# EAGLE design inductance_meter (EAGLE 9.6.2)
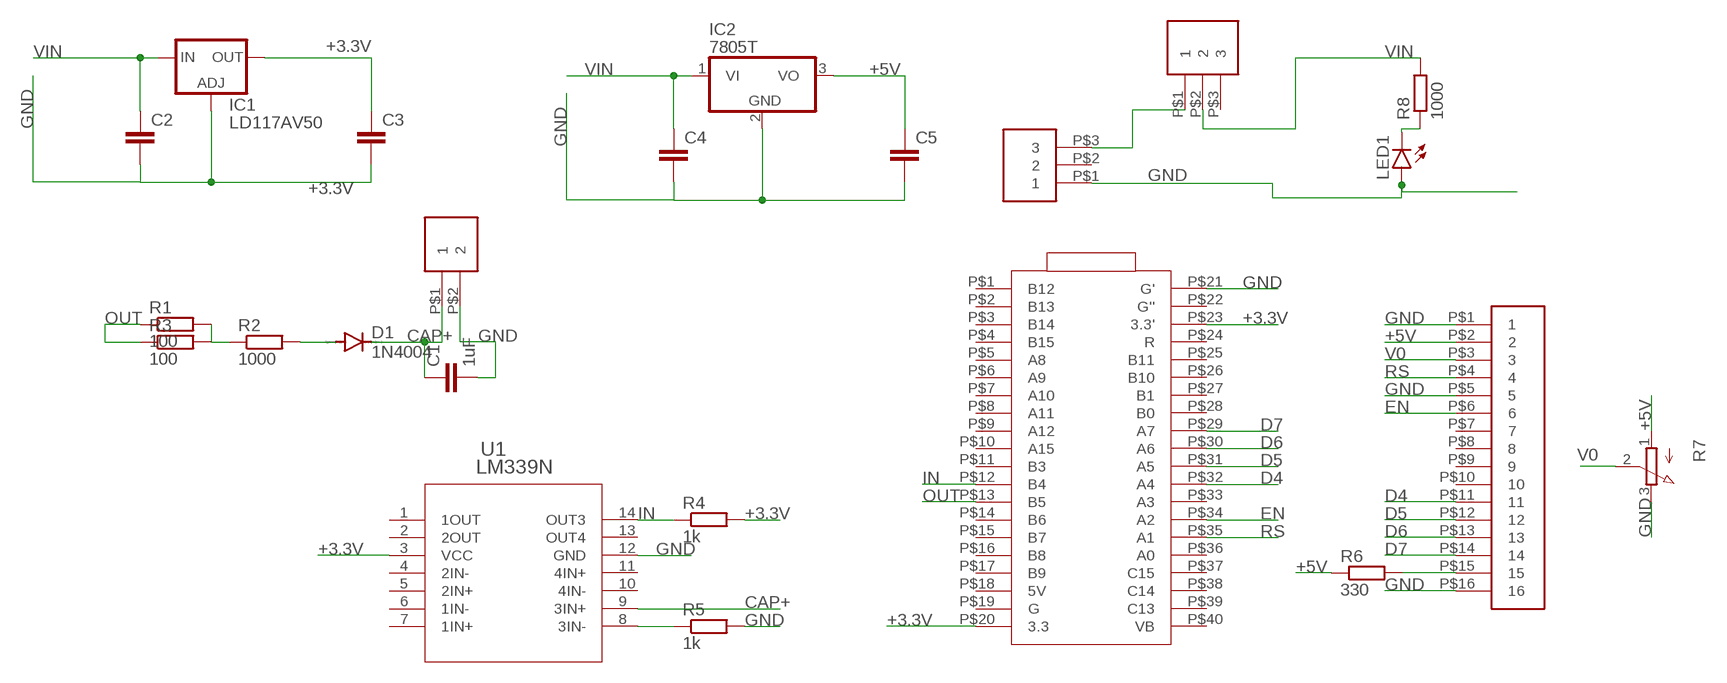
[diagram p0: schematic, sheet 1]

## Parts
C1  1uF  C-EU050-075X075  [C050-075X075]
C2  C-EU025-030X050  [C025-030X050]
C3  C-EU025-030X050  [C025-030X050]
C4  C-EU025-030X050  [C025-030X050]
C5  C-EU025-030X050  [C025-030X050]
D1  1N4004  [DO41-10]
IC1  LD117AV50  [TO220L1]
IC2  7805T  [TO220H]
LED1  TLLR4400  [LED3MM]
R1  100  R-EU_0817/22  [P0817/22]
R2  1000  R-EU_0817/22  [P0817/22]
R3  100  R-EU_0817/22  [P0817/22]
R4  1k  R-EU_0817/22  [P0817/22]
R5  1k  R-EU_0817/22  [P0817/22]
R6  330  R-EU_0617/17  [0617/17]
R7  3RP/1610N  [3RP/1610N]
R8  1000  R-EU_0817/22  [P0817/22]
U1  LM339N  [PDIP14_6P60X19P69_ONS]
U$2  HEADER_16  [HEADER_16_FOOT]
U$3  BLUE_PILL_EA  [BLUE_PILL_FOOT]
U$5  HEADER_2  [HEADER_2_FOOT]
U$7  HEADER_3  [HEADER_3_FOOT]
U$9  HEADER_3  [HEADER_3_FOOT]

## Nets
+3.3V: C3.1 IC1.2(OUT) R4.2 U1.3(VCC) U$3.P$20(3.3) U$3.P$23(3.3')
+5V: C5.1 IC2.3(VO) R6.1 R7.1(A) U$2.P$2
CAP+: C1.1 D1.C U1.9(3IN+) U$5.P$1
D4: U$2.P$11 U$3.P$32(A4)
D5: U$2.P$12 U$3.P$31(A5)
D6: U$2.P$13 U$3.P$30(A6)
D7: U$2.P$14 U$3.P$29(A7)
EN: U$2.P$6 U$3.P$34(A2)
GND: C1.2 C2.2 C3.2 C4.2 C5.2 IC1.1(ADJ) IC2.2(GND) LED1.A R5.2 R7.3(E) U1.12(GND) U$2.P$1 U$2.P$5 U$2.P$16 U$3.P$21(G') U$5.P$2 U$9.P$1
IN: R4.1 U1.14(OUT3) U$3.P$12(B4)
N$1: R6.2 U$2.P$15
N$2: R5.1 U1.8(3IN-)
N$3: R1.2 R2.1 R3.2
N$4: D1.A R2.2
N$5: LED1.K(C) R8.1
N$10: U$7.P$1 U$9.P$3
OUT: R1.1 R3.1 U$3.P$13(B5)
RS: U$2.P$4 U$3.P$35(A1)
V0: R7.2(S) U$2.P$3
VIN: C2.1 C4.1 IC1.3(IN) IC2.1(VI) R8.2 U$7.P$2
Unconnected: U1.1(1OUT) U1.2(2OUT) U1.4(2IN-) U1.5(2IN+) U1.6(1IN-) U1.7(1IN+) U1.10(4IN-) U1.11(4IN+) U1.13(OUT4) U$2.P$7 U$2.P$8 U$2.P$9 U$2.P$10 U$3.P$1(B12) U$3.P$2(B13) U$3.P$3(B14) U$3.P$4(B15) U$3.P$5(A8) U$3.P$6(A9) U$3.P$7(A10) U$3.P$8(A11) U$3.P$9(A12) U$3.P$10(A15) U$3.P$11(B3) U$3.P$14(B6) U$3.P$15(B7) U$3.P$16(B8) U$3.P$17(B9) U$3.P$18(5V) U$3.P$19(G) U$3.P$22(G'') U$3.P$24(R) U$3.P$25(B11) U$3.P$26(B10) U$3.P$27(B1) U$3.P$28(B0) U$3.P$33(A3) U$3.P$36(A0) U$3.P$37(C15) U$3.P$38(C14) U$3.P$39(C13) U$3.P$40(VB) U$7.P$3 U$9.P$2

## Library data of the parts
C1-C5 = rcl:C-EU: CAPACITOR, European symbol; SPICEPREFIX: C
D1 = diode:1N4004: DIODE general purpose rectifier, 1 A
IC1 = v-reg:LD117A?*: Low drop fixed and adjustable positive voltage regulators 1 A Source: http://www.st.com/stonline/products/literature/ds/7194/ld1117axx.pdf
IC2 = linear:78*: Positive VOLTAGE REGULATOR Source: http://cache.national.com/ds/LM/LM78L05.pdf http://www.fairchildsemi.com/ds/LM/LM7805.pdf
LED1 = led:TLLR4400: Low Current (2mA) LED 3 mm Tinted Diffused Package color RED Source: Data sheet <http://www.farnell.com/datasheets/391100.pdf>; MF: VISHAY SEMICONDUCTOR; OC_FARNELL: 1612437
R1-R6 R8 = rcl:R-EU_: RESISTOR, European symbol; SPICEPREFIX: R
R7 = pot:3RP/1610N: 16mm Potentiometer one level Source: http://www.alphapotentiometers.net/html/16mm_pot_2.html
U1 = lm339:LM339N; BUILT_BY: EMA_Jessica; COPYRIGHT: Copyright (C) 2018 Accelerated Designs. All rights reserved; MANUFACTURER_PART_NUMBER: LM339N; SOURCELIBRARY: ON_Semiconductor_2019-12-30; VENDOR: ON Semiconductor
U$2 = header:HEADER_16
U$3 = blue_pill_ea:BLUE_PILL_EA
U$5 = header:HEADER_2
U$7 U$9 = header:HEADER_3

## Board
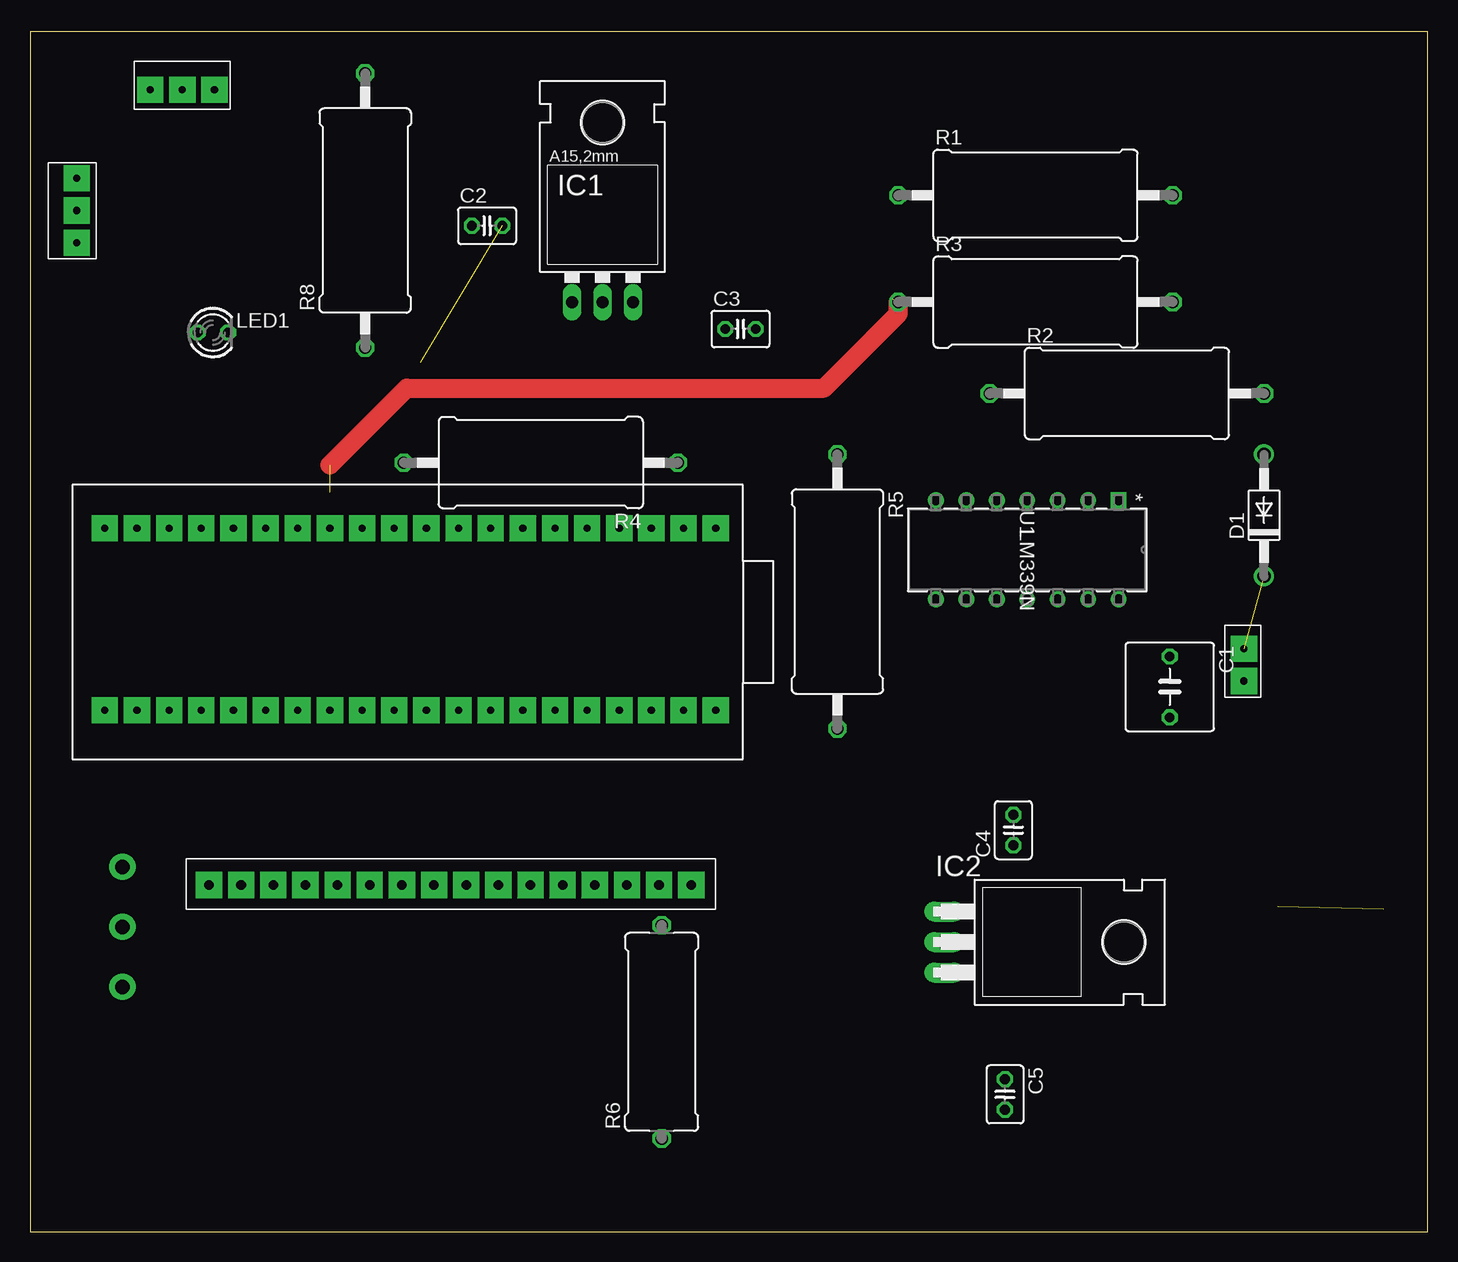
[diagram p1: board, top side]
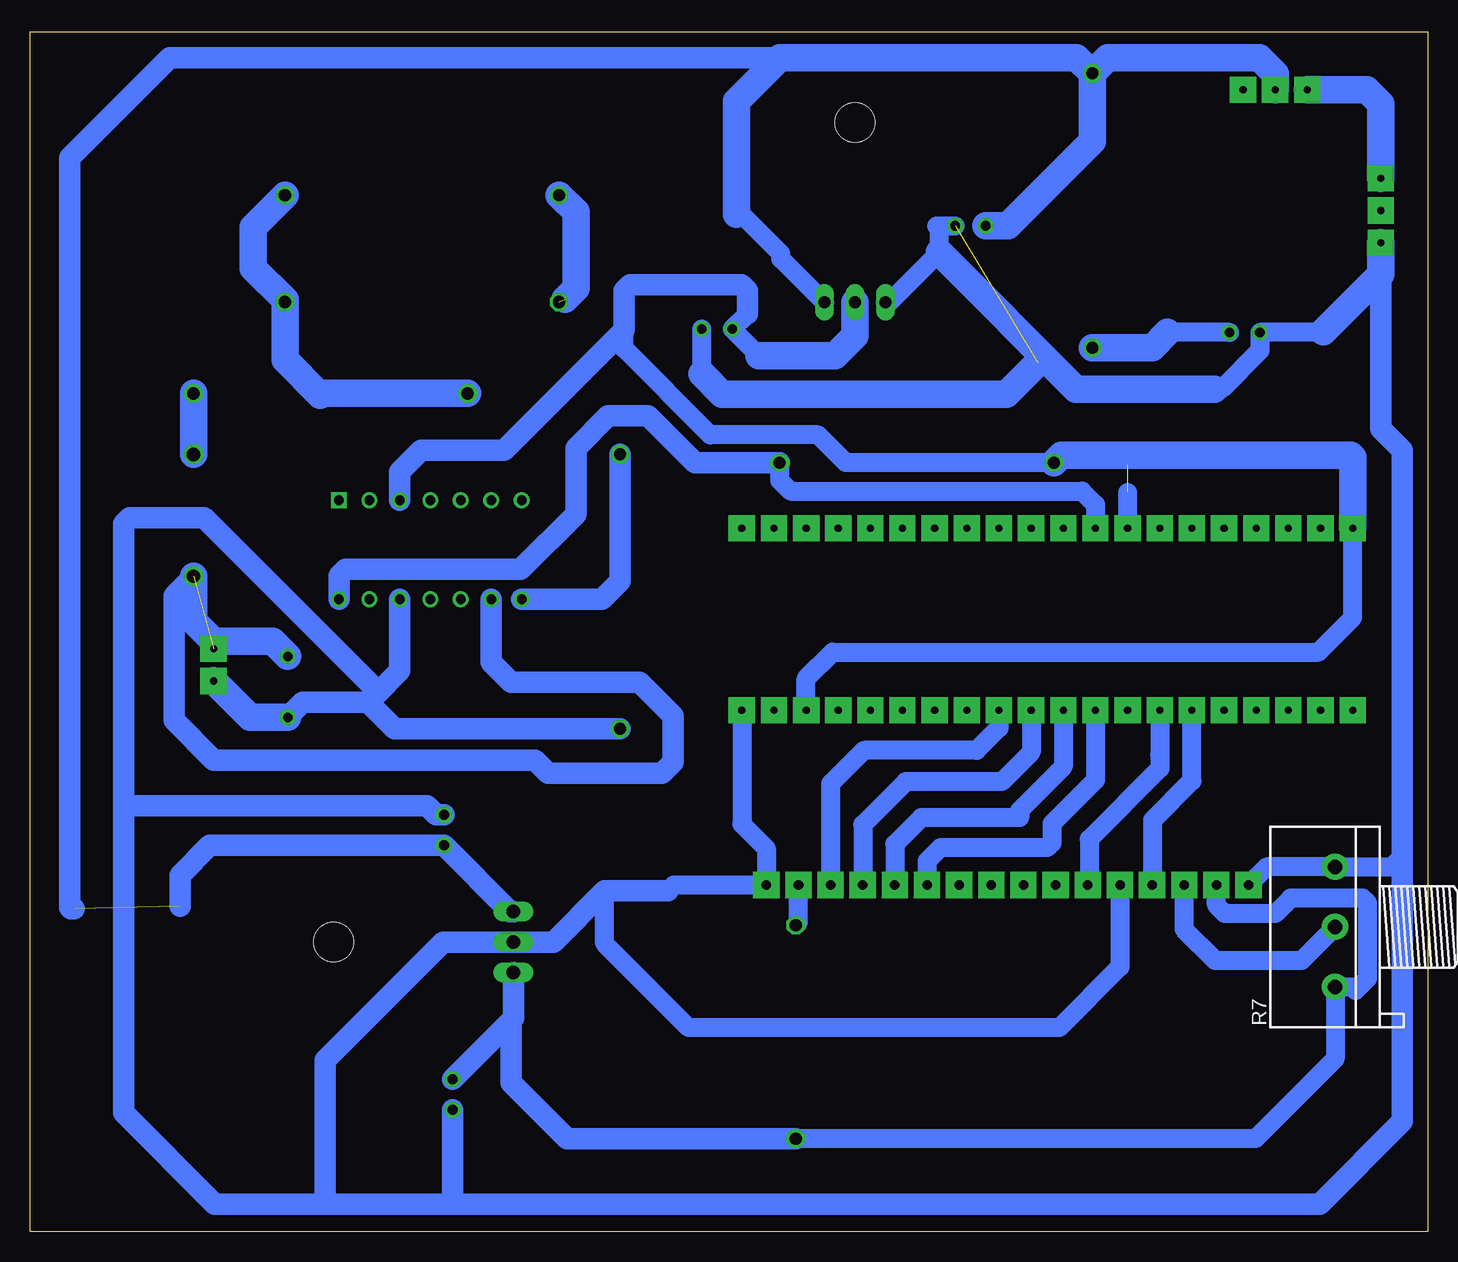
[diagram p2: board, bottom side, seen from below]

Size 116.5 x 100 mm. Coordinates in mm from the lower left corner, seen from the top.
Outline: 0,0 116.5,0 116.5,100 0,100 0,0
Copper layers (1*16): Top 0.035mm / dielectric 1.5mm / Bottom 0.035mm
Design rules "default": minimum track width 6mil, minimum drill 0.35mm, track to track 6mil, track to pad 6mil, pad to pad 6mil, via to via 6mil, smd to smd 6mil, copper to edge 40mil, drill to drill 6mil, minimum pad ring 10mil, minimum via ring 8mil, stop-mask expansion 4mil, vias tented up to drill 0mil, thermal gap 10mil

### Footprints (pad centres in the part's own frame; a part is rotated, then mirrored left to right if it is on the bottom)
C050-075X075 = drill 0.813 octagon: 1 -2.54,0; 2 2.54,0
C025-030X050 = drill 0.813 octagon: 1 -1.27,0; 2 1.27,0
DO41-10 = drill 1.118: A 5.08,0; C -5.08,0
TO220L1 = drill 1.016 long: 1 -2.54,-3.81; 2 0,-3.81; 3 2.54,-3.81 | hole 3.302: 0,11.176
TO220H = drill 1.118 long: 1 -2.54,-10.16; 2 0,-10.16; 3 2.54,-10.16 | hole 3.302: 0,4.826
LED3MM = drill 0.813 octagon: A -1.27,0; K 1.27,0
P0817/22 = drill 1.016 octagon: 1 -11.43,0; 2 11.43,0
0617/17 = drill 1.016 octagon: 1 -8.89,0; 2 8.89,0
3RP/1610N = drill 1.2 pad 2.184: 1 -5,0; 2 0,0; 3 5,0
PDIP14_6P60X19P69_ONS = drill 0.813 pad 1.321 square: 1 0,0 | drill 0.813 pad 1.321: 2 0,-2.54; 3 0,-5.08; 4 0,-7.62; 5 0,-10.16; 6 0,-12.7; 7 0,-15.24; 8 8.255,-15.24; 9 8.255,-12.7; 10 8.255,-10.16; 11 8.255,-7.62; 12 8.255,-5.08; 13 8.255,-2.54; 14 8.255,0
HEADER_16_FOOT = drill 0.8 pad 2.184 square: P$1 -1.5,17.72; P$2 -1.5,15.04; P$3 -1.5,12.36; P$4 -1.5,9.68; P$5 -1.5,7; P$6 -1.5,4.32; P$7 -1.5,1.64; P$8 -1.5,-1.04; P$9 -1.5,-3.72; P$10 -1.5,-6.4; P$11 -1.5,-9.08; P$12 -1.5,-11.76; P$13 -1.5,-14.44; P$14 -1.5,-17.12; P$15 -1.5,-19.8; P$16 -1.5,-22.48
BLUE_PILL_FOOT = drill 0.6 pad 2.184 square: P$1 -7.82,21.87; P$2 -7.82,19.19; P$3 -7.82,16.51; P$4 -7.82,13.83; P$5 -7.82,11.15; P$6 -7.82,8.47; P$7 -7.82,5.79; P$8 -7.82,3.11; P$9 -7.82,0.43; P$10 -7.82,-2.25; P$11 -7.82,-4.93; P$12 -7.82,-7.61; P$13 -7.82,-10.29; P$14 -7.82,-12.97; P$15 -7.82,-15.65; P$16 -7.82,-18.33; P$17 -7.82,-21.01; P$18 -7.82,-23.69; P$19 -7.82,-26.37; P$20 -7.82,-29.05; P$21 7.36,21.87; P$22 7.36,19.19; P$23 7.36,16.51; P$24 7.36,13.83; P$25 7.36,11.15; P$26 7.36,8.47; P$27 7.36,5.79; P$28 7.36,3.11; P$29 7.36,0.43; P$30 7.36,-2.25; P$31 7.36,-4.93; P$32 7.36,-7.61; P$33 7.36,-10.29; P$34 7.36,-12.97; P$35 7.36,-15.65; P$36 7.36,-18.33; P$37 7.36,-21.01; P$38 7.36,-23.69; P$39 7.36,-26.37; P$40 7.36,-29.05
HEADER_2_FOOT = drill 0.6 pad 2.184 square: P$1 -0.4,-0.96; P$2 -0.4,-3.64
HEADER_3_FOOT = drill 0.6 pad 2.184 square: P$1 -1.36,2.68; P$2 -1.36,0; P$3 -1.36,-2.68

### Placement (x,y rotation side)
C1  95.01,45.39 270 top
C2  38.1,83.82 0 top
C3  59.23,75.22 0 top
C4  81.98,33.46 90 top
C5  81.28,11.43 270 top
D1  102.87,59.69 90 top
IC1  47.73,81.25 0 top
IC2  86.36,24.13 270 top
LED1  15.24,74.93 0 top
R1  83.82,86.36 0 top
R2  91.44,69.85 0 top
R3  83.82,77.47 0 top
R4  42.58,64.08 180 top
R5  67.31,53.34 270 top
R6  52.66,16.64 90 top
R7  7.7,25.4 90 bottom
R8  27.94,85.09 90 top
U1  90.75,60.95 270 top
U$2  32.64,30.38 90 top
U$3  35.29,50.8 270 top
U$5  101.6,49.53 0 top
U$7  12.7,96.52 90 top
U$9  2.54,85.09 180 top

### Tracks (layer width: path | path; a pad name or v marks a point on that pad's centre or on a via)
+3.3V
  Bottom 1.6: R4.2 48.48,64.08 50.8,66.4 59.8,66.4 67,73.6 67,75.1 | U$3.P$23 51.8,46.1 49.6,48.3 9.1,48.3 6.24,51.16 U$3.P$20 | 55.74,73 C3.1 56.7,76.48
  Bottom 1.8: U1.3 85.67,63.33 83.9,65.1 77,65.1 67,75.1 67,78.4 66.5,78.9 57.2,78.9 56.7,78.4 56.7,76.48
  Bottom 2.3: IC1.2 47.73,74.67 49.4,73 55.74,73 | U$3.P$20 6.24,64.54 6.4,64.7 30.53,64.7 R4.2
+5V
  Bottom 1.6: R6.1 14.35,7.75 7.7,14.4 R7.1 6.3,20.4 6,20.1 5,21.1 5,27.4 5.4,27.8 11.4,27.8 12.7,26.5 16.9,26.5 17.6,27.2 U$2.P$2
  Bottom 1.8: C5.1 76.4,17.58 | IC2.3 76.2,17.78 76.4,17.58 | R6.1 71.75,7.75 76.4,12.4 76.4,17.58
CAP+  (1 unrouted)
  Bottom 1.8: U1.9 78.05,47.45 76.4,45.8 65.7,45.8 62.9,43 62.9,39.1 63.8,38.2 73.3,38.2 74.4,39.3 101.2,39.3 104.5,42.6 104.5,52.98 D1.C
  Bottom 2.3: D1.C 102.87,50.87 101.2,49.2 96.28,49.2 C1.1
D4
  Bottom 1.6: U$3.P$32 27.68,37.62 31.3,34 31.3,32.4 31.7,32 40.6,32 41.72,30.88 U$2.P$11
D5
  Bottom 1.6: U$3.P$31 30.36,38.74 34,35.1 34,34.5 42.2,34.5 44.4,32.3 U$2.P$12
D6
  Bottom 1.6: U$3.P$30 33.04,39.96 35.5,37.5 43.5,37.5 47.08,33.92 U$2.P$13
D7
  Bottom 1.6: U$3.P$29 35.72,41.98 37.6,40.1 47,40.1 49.76,37.34 U$2.P$14
EN
  Bottom 1.6: U$3.P$34 22.32,39.72 22.3,39.7 22.3,38.6 28.2,32.7 28.2,29 U$2.P$6
GND  (1 unrouted)
  Bottom 1.6: 63.3,28.4 62.82,28.88 U$2.P$16 55.12,31.92 57.16,33.96 U$3.P$21 | 2.1,31.3 3,30.4 R7.3 13.4,30.4 U$2.P$1 | U$2.P$5 25.64,22.06 30.7,17 61.6,17 68.6,24 68.6,28.4 | 8.7,75 8.77,74.93 LED1.A 13.97,73.43 17.2,70.2 17.77,70.2 | IC1.1 44.86,77.44 40.7,81.6 40.7,83.6 40.9,83.8 40.88,83.82 C2.2 | 60.5,71.5 C3.2
  Bottom 1.8: U1.12 85.67,46.73 87.65,44.75 | 87.65,44.75 88.3,44.1 | 88.3,44.1 93.76,44.1 C1.2 | R5.2 86.11,41.91 88.3,44.1 | U$9.P$1 3.9,66.9 2.1,65.1 2.1,31.3 2.1,9.2 9,2.3 81.1,2.3 | 81.1,2.3 91.9,2.3 | 91.9,2.3 101.1,2.3 108.7,9.9 108.7,35.5 | 87.65,44.75 87.65,45.15 102,59.5 108.2,59.5 108.7,59 108.7,35.5 | C4.2 82.63,34.73 83.4,35.5 108.7,35.5 | C5.2 81.28,2.48 81.1,2.3 | 63.3,28.4 68.6,28.4 72.87,24.13 IC2.2 82.07,24.13 91.9,14.3 91.9,2.3
  Bottom 2.3: U$9.P$1 3.9,79.8 8.7,75 | 17.77,70.2 29.3,70.2 40.7,81.6 | 32.5,72.4 35.1,69.8 58.8,69.8 60.5,71.5 | C1.2 98.16,42.85 U$5.P$2
IN
  Bottom 1.6: R4.1 54.01,62.61 53.1,61.7 28.8,61.7 27.68,60.58 U$3.P$12
  Bottom 1.8: U1.14 90.75,54.65 90.2,55.2 75.6,55.2 71,59.8 71,65.3 68.3,68 65,68 61.08,64.08 R4.1
N$1
  Bottom 1.6: R6.2 52.44,25.75 U$2.P$15
N$2
  Bottom 1.8: U1.8 68.81,52.7 67.31,54.19 R5.1
N$3
  Bottom 2.3: R1.2 97.9,83.71 97.9,80.3 95.25,77.65 R3.2 95.25,72.65 92.3,69.7 92.15,69.85 R2.1
N$4
  Bottom 2.3: R2.2 D1.A
N$5
  Bottom 1.6: LED1.K 21.67,74.93
  Bottom 2.3: R8.1 22.94,73.66 21.67,74.93
N$10
  Bottom 2.3: U$9.P$3 3.9,94 5.06,95.16 U$7.P$1
OUT  (2 unrouted)
  Top 1.6: R3.1 72.39,76.49 66.2,70.3 31.4,70.3 25,63.9
  Bottom 1.6: U$3.P$13 25,61.6
  Bottom 2.3: R1.1 71,84.97 71,78.6 71.9,77.7
RS
  Bottom 1.6: U$2.P$4 22.9,28.94 22.9,34.3 19.64,37.56 U$3.P$35
V0
  Bottom 1.6: U$2.P$3 20.3,28.86 20.3,25.2 17.7,22.6 10.5,22.6 R7.2
VIN  (1 unrouted)
  Bottom 1.6: IC1.3 53.9,81.07 53.9,81.5 57.17,84.77 57.6,84.77
  Bottom 1.8: 53.97,97.83 104.87,97.83 113.2,89.5 113.2,27 113.1,26.9 112.8,26.9 | IC2.1 76.46,26.67 C4.1 101.51,32.19 104,29.7 104,27.1
  Bottom 2.3: U$7.P$2 12.7,96.51 14.03,97.83 26.63,97.83 R8.2 | C2.1 34.98,83.82 27.94,90.86 R8.2 | 57.6,84.77 57.6,94.2 53.97,97.83 29.25,97.83 R8.2